# EAGLE design TubeAmp_power (EAGLE 7.2.0)
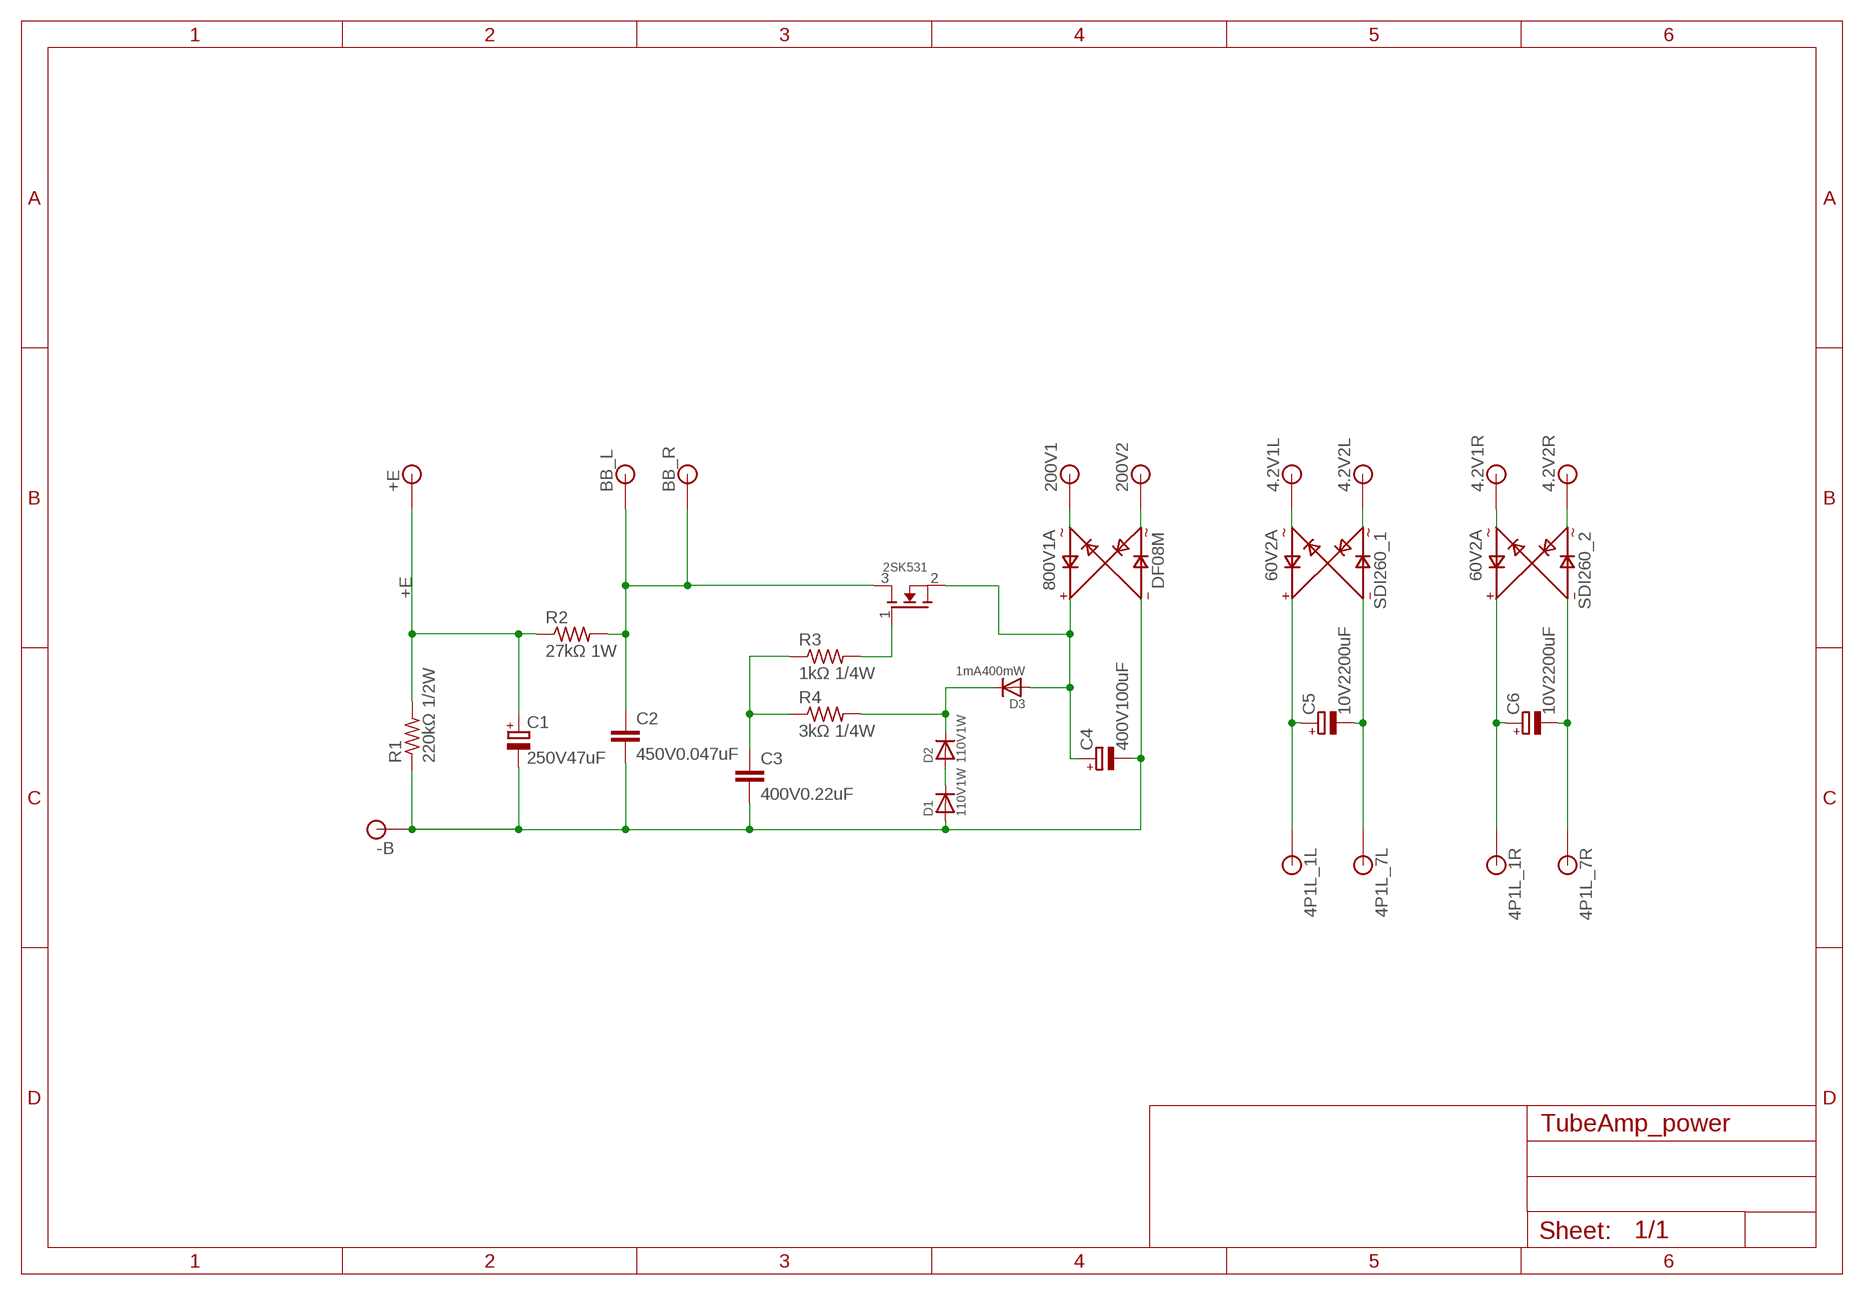
[diagram p0: schematic, sheet 1]

## Parts
2SK531  MOSFET_N  [MOSFET_N]
4.2V1L  PIN-1X11.2MM  [PIN-1X1_1.2MM]
4.2V1R  PIN-1X11.2MM  [PIN-1X1_1.2MM]
4.2V2L  PIN-1X11.2MM  [PIN-1X1_1.2MM]
4.2V2R  PIN-1X11.2MM  [PIN-1X1_1.2MM]
4P1L_1L  PIN-1X11.2MM  [PIN-1X1_1.2MM]
4P1L_1R  PIN-1X11.2MM  [PIN-1X1_1.2MM]
4P1L_7L  PIN-1X11.2MM  [PIN-1X1_1.2MM]
4P1L_7R  PIN-1X11.2MM  [PIN-1X1_1.2MM]
200V1  PIN-1X11.2MM  [PIN-1X1_1.2MM]
200V2  PIN-1X11.2MM  [PIN-1X1_1.2MM]
+E  PIN-1X11.2MM  [PIN-1X1_1.2MM]
-B  PIN-1X11.2MM  [PIN-1X1_1.2MM]
BB_L  PIN-1X11.2MM  [PIN-1X1_1.2MM]
BB_R  PIN-1X11.2MM  [PIN-1X1_1.2MM]
C1  250V47uF  CPOL50_90  [CPOL50_90]
C2  450V0.047uF  C150_63X200  [C150_63X200]
C3  400V0.22uF  C100_63X130  [C100_63X130]
C4  400V100uF  CPOL75_150  [CPOL75_150]
C5  10V2200uF  CPOL50_90  [CPOL50_90]
C6  10V2200uF  CPOL50_90  [CPOL50_90]
D1  110V1W  DIODE  [DIODE_63]
D2  110V1W  DIODE  [DIODE_63]
D3  1mA400mW  DIODE  [DIODE_63]
DF08M  800V1A  RECTIFIRE  [RECTIFIER]
R1  220kΩ 1/2W  RESISTOR1/2W  [RESISTOR_1/2W]
R2  27kΩ 1W  RESISTOR1W  [RESISTOR_1W]
R3  1kΩ 1/4W  RESISTOR1/4W  [RESISTOR_1/4W]
R4  3kΩ 1/4W  RESISTOR1/4W  [RESISTOR_1/4W]
SDI260_1  60V2A  RECTIFIRE  [RECTIFIER]
SDI260_2  60V2A  RECTIFIRE  [RECTIFIER]

## Nets
4.2V1L [power]: 4.2V1L.1 SDI260_1.AC2
4.2V1R [power]: 4.2V1R.1 SDI260_2.AC2
4.2V2L [power]: 4.2V2L.1 SDI260_1.AC1
4.2V2R [power]: 4.2V2R.1 SDI260_2.AC1
4P1L_1L [power]: 4P1L_1L.1 C5.+ SDI260_1.+
4P1L_1R [power]: 4P1L_1R.1 C6.+ SDI260_2.+
4P1L_7L [power]: 4P1L_7L.1 C5.- SDI260_1.-
4P1L_7R [power]: 4P1L_7R.1 C6.- SDI260_2.-
200V1 [power]: 200V1.1 DF08M.AC2
200V2 [power]: 200V2.1 DF08M.AC1
+E [edit]: +E.1 C1.+ R1.2 R2.1
BB [edit]: 2SK531.3(D) BB_L.1 BB_R.1 C2.1 R2.2
GND [GND]: -B.1 C1.- C2.2 C3.2 C4.- D1.A DF08M.- R1.1
N$1 [edit]: 2SK531.1(G) R3.2
N$2 [edit]: 2SK531.2(S) C4.+ D3.A DF08M.+
N$3 [edit]: C3.1 R3.1 R4.1
N$4 [edit]: D2.K D3.K R4.2
N$6 [edit]: D1.K D2.A

## Library data of the parts
2SK531 = GClue-TubeAmp:MOSFET_N
4.2V1L 4.2V1R 4.2V2L 4.2V2R 4P1L_1L 4P1L_1R 4P1L_7L 4P1L_7R 200V1 200V2 +E -B BB_L BB_R = GClue:PIN-1X1
C1 C4-C6 = GClue-TubeAmp:CPOL
C2 C3 = GClue-TubeAmp:C
D1-D3 = GClue-TubeAmp:DIODE
DF08M SDI260_1 SDI260_2 = GClue-TubeAmp:RECTIFIRE
R1-R4 = GClue-TubeAmp:RESISTOR

## Net classes
1 power: width 0.762 mm, drill 0.254 mm
2 GND: width 0.762 mm, drill 0.229 mm
3 edit: width 0.762 mm

## Board
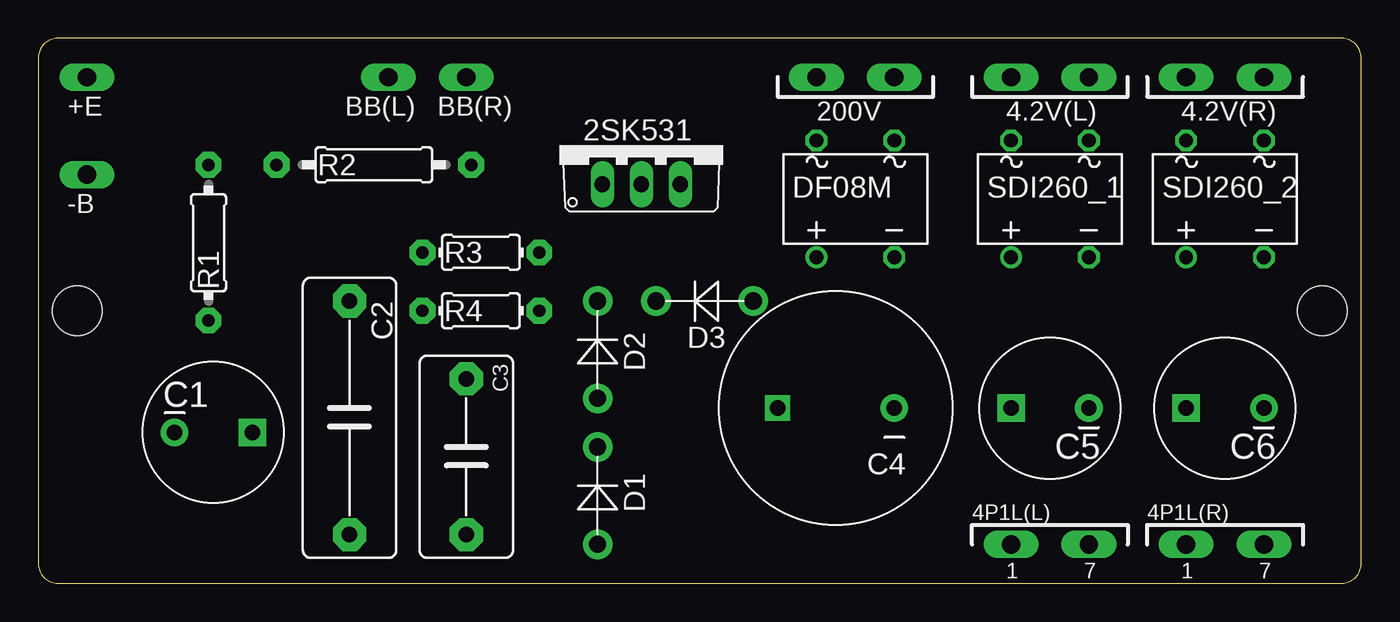
[diagram p1: board, top side]
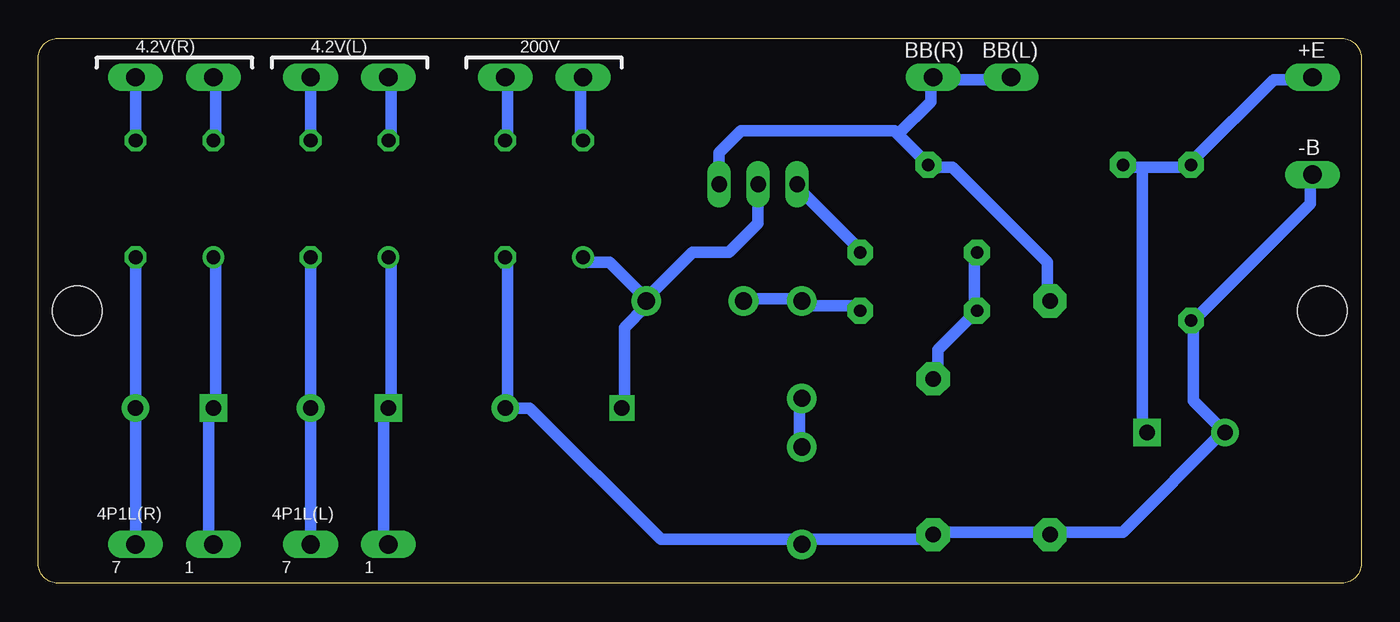
[diagram p2: board, bottom side, seen from below]

Size 86.36 x 35.56 mm. Coordinates in mm from the lower left corner, seen from the top.
Outline: 1.27,35.56 arc90 0,34.29 0,1.27 arc90 1.27,0 85.09,0 arc90 86.36,1.27 86.36,34.29 arc90 85.09,35.56 1.27,35.56
Copper layers (1*16): Top 0.035mm / dielectric 1.5mm / Bottom 0.035mm
Design rules "default *": minimum track width 10mil, minimum drill 24mil, track to track 65mil, track to pad 50mil, pad to pad 40mil, via to via 40mil, smd to smd 40mil, copper to edge 40mil, drill to drill 8mil, minimum pad ring 10mil, minimum via ring 8mil, stop-mask expansion 4mil, vias tented up to drill 0mil, thermal gap 10mil
Holes 3.2 mm at 2.54,17.78 83.82,17.78

### Footprints (pad centres in the part's own frame; a part is rotated, then mirrored left to right if it is on the bottom)
MOSFET_N = drill 1.016 long: 1 -2.54,0; 2 0,0; 3 2.54,0
PIN-1X1_1.2MM = drill 1.2 long: 1 0,0
CPOL50_90 = drill 1 pad 1.8 square: + 2.54,0 | drill 1 pad 1.8: - -2.54,0
C150_63X200 = drill 1.016 pad 2.159 octagon: 1 -7.62,0; 2 7.62,0
C100_63X130 = drill 1.016 pad 2.159 octagon: 1 -5.08,0; 2 5.08,0
CPOL75_150 = drill 1 pad 1.651 square: + 3.81,0 | drill 1 pad 1.8: - -3.81,0
DIODE_63 = drill 1.118 pad 1.93: A -3.81,0; K 2.54,0
RECTIFIER = drill 0.9: + -2.54,-3.81 | drill 0.9 octagon: - 2.54,-3.81; AC1 2.54,3.81; AC2 -2.54,3.81
RESISTOR_1/2W = drill 0.813 pad 1.676 octagon: 1 -5.08,0; 2 5.08,0
RESISTOR_1W = drill 0.813 pad 1.676 octagon: 1 -6.35,0; 2 6.35,0
RESISTOR_1/4W = drill 0.813 pad 1.676 octagon: 1 -3.81,0; 2 3.81,0

### Placement (x,y rotation side)
2SK531  39.37,26.04 0 top
4.2V1L  63.5,33.02 0 top
4.2V1R  74.93,33.02 0 top
4.2V2L  68.58,33.02 0 top
4.2V2R  80.01,33.02 0 top
4P1L_1L  63.5,2.54 0 top
4P1L_1R  74.93,2.54 0 top
4P1L_7L  68.58,2.54 0 top
4P1L_7R  80.01,2.54 0 top
200V1  50.8,33.02 0 top
200V2  55.88,33.02 0 top
+E  3.17,33.02 0 top
-B  3.17,26.67 0 top
BB_L  22.86,33.02 0 top
BB_R  27.94,33.02 0 bottom
C1  11.43,9.84 0 top
C2  20.32,10.79 270 top
C3  27.94,8.26 270 top
C4  52.07,11.43 180 top
C5  66.04,11.43 180 top
C6  77.47,11.43 180 top
D1  36.51,6.35 90 top
D2  36.51,15.88 90 top
D3  42.86,18.41 180 top
DF08M  53.34,25.08 0 top
R1  11.11,22.23 90 top
R2  21.91,27.3 0 top
R3  28.89,21.59 0 top
R4  28.89,17.78 0 top
SDI260_1  66.04,25.08 0 top
SDI260_2  77.47,25.08 0 top

### Tracks (layer width: path | path; a pad name or v marks a point on that pad's centre or on a via)
4.2V1L
  Bottom 0.762: SDI260_1.AC2 63.34,29.05 63.34,32.86 4.2V1L.1
4.2V1R
  Bottom 0.762: SDI260_2.AC2 74.77,29.05 74.77,32.86 4.2V1R.1
4.2V2L
  Bottom 0.762: 4.2V2L.1 SDI260_1.AC1
4.2V2R
  Bottom 0.762: 4.2V2R.1 SDI260_2.AC1
4P1L_1L
  Bottom 0.762: SDI260_1.+ 63.34,20.95 63.34,11.43 C5.+ 63.82,11.43 63.82,2.86 4P1L_1L.1
4P1L_1R
  Bottom 0.762: SDI260_2.+ 74.77,20.95 74.77,11.43 C6.+ 75.25,11.43 75.25,2.86 4P1L_1R.1
4P1L_7L
  Bottom 0.762: SDI260_1.- C5.- 4P1L_7L.1
4P1L_7R
  Bottom 0.762: SDI260_2.- C6.- 4P1L_7R.1
200V1
  Bottom 0.762: DF08M.AC2 50.96,29.05 50.96,32.86 200V1.1
200V2
  Bottom 0.762: DF08M.AC1 55.72,29.05 55.72,32.86 200V2.1
+E
  Bottom 0.762: 14.29,27.15 15.24,27.15 R2.1 | 14.29,27.15 11.43,27.15 R1.2 10.95,27.62 5.71,32.86 3.33,32.86 +E.1 | 14.29,27.15 14.29,10 C1.+
BB
  Bottom 0.762: BB_L.1 22.86,32.86 27.62,32.86 BB_R.1 28.1,32.86 28.1,31.43 30.24,29.29 | 2SK531.3 41.91,28.1 40.48,29.53 30.48,29.53 30.24,29.29 | 30.24,29.29 R2.2 28.1,27.15 26.67,27.15 20.48,20.95 20.48,18.57 C2.1
GND
  Bottom 0.762: 10.95,17.14 10.95,11.91 C1.- 8.89,10 15.56,3.33 20,3.33 C2.2 20.48,3.33 27.62,3.33 C3.2 28.1,2.86 36.2,2.86 D1.A 36.67,2.86 45.72,2.86 54.29,11.43 55.72,11.43 | 10.95,17.14 3.33,24.77 3.33,26.67 -B.1 | 10.95,17.14 R1.1 | 55.72,11.43 55.72,20.95 DF08M.- | 55.72,11.43 C4.-
N$1
  Bottom 0.762: 2SK531.1 36.67,25.72 32.86,21.91 R3.2
N$2
  Bottom 0.762: 46.67,18.57 49.05,20.95 50.48,20.95 DF08M.+ | 46.67,18.57 D3.A 46.67,18.1 48.1,16.67 48.1,11.43 C4.+ | 46.67,18.57 43.66,21.59 41.27,21.59 39.37,23.5 2SK531.2
N$3
  Bottom 0.762: R3.1 25.24,21.43 25.24,18.1 R4.1 27.62,15.24 27.62,13.34 C3.1
N$4
  Bottom 0.762: R4.2 32.86,18.1 36.2,18.1 D2.K 36.67,18.57 40.01,18.57 D3.K
N$6
  Bottom 0.762: D1.K 36.67,9.05 36.67,11.91 D2.A

### Text on the board
tPlace: +E | BB(L) | BB(R) | 200V | 4.2V(L) | 4.2V(R) | -B | 4P1L(L) | 4P1L(R) | 1 | 7 | 1 | 7
bPlace: 200V | 4.2V(L) | 4.2V(R) | +E | BB(L) | BB(R) | -B | 4P1L(L) | 4P1L(R) | 1 | 7 | 1 | 7